# EAGLE design single_digit_v1 (EAGLE 6.5.0)
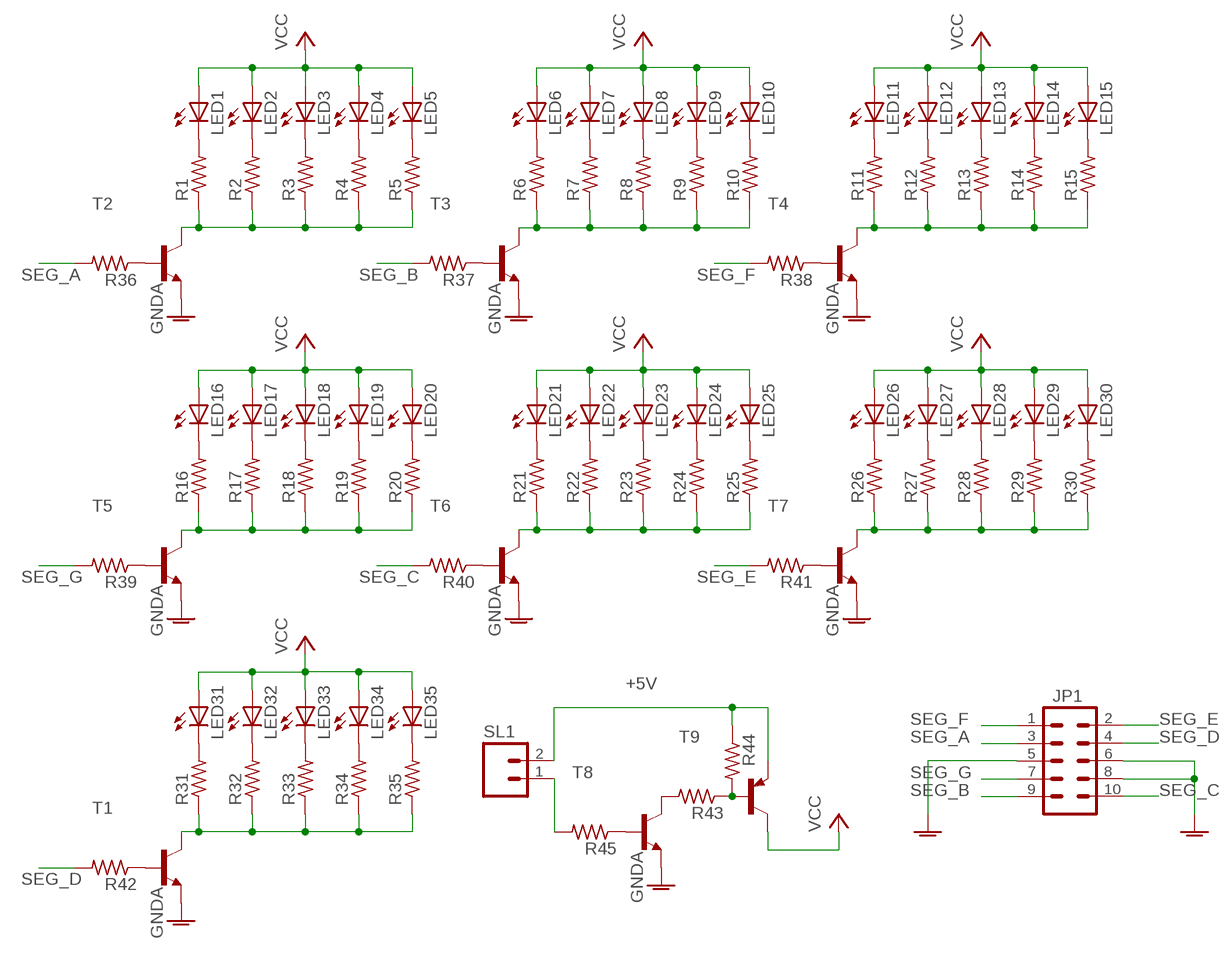
[diagram p0: schematic, sheet 1]

## Parts
JP1  M05X2SHD_SMD  [2X5-SHROUDED_SMD]
LED1  LED5MM  [LED5MM]
LED2  LED5MM  [LED5MM]
LED3  LED5MM  [LED5MM]
LED4  LED5MM  [LED5MM]
LED5  LED5MM  [LED5MM]
LED6  LED5MM  [LED5MM]
LED7  LED5MM  [LED5MM]
LED8  LED5MM  [LED5MM]
LED9  LED5MM  [LED5MM]
LED10  LED5MM  [LED5MM]
LED11  LED5MM  [LED5MM]
LED12  LED5MM  [LED5MM]
LED13  LED5MM  [LED5MM]
LED14  LED5MM  [LED5MM]
LED15  LED5MM  [LED5MM]
LED16  LED5MM  [LED5MM]
LED17  LED5MM  [LED5MM]
LED18  LED5MM  [LED5MM]
LED19  LED5MM  [LED5MM]
LED20  LED5MM  [LED5MM]
LED21  LED5MM  [LED5MM]
LED22  LED5MM  [LED5MM]
LED23  LED5MM  [LED5MM]
LED24  LED5MM  [LED5MM]
LED25  LED5MM  [LED5MM]
LED26  LED5MM  [LED5MM]
LED27  LED5MM  [LED5MM]
LED28  LED5MM  [LED5MM]
LED29  LED5MM  [LED5MM]
LED30  LED5MM  [LED5MM]
LED31  LED5MM  [LED5MM]
LED32  LED5MM  [LED5MM]
LED33  LED5MM  [LED5MM]
LED34  LED5MM  [LED5MM]
LED35  LED5MM  [LED5MM]
R1  R-US_M0805  [M0805]
R2  R-US_M0805  [M0805]
R3  R-US_M0805  [M0805]
R4  R-US_M0805  [M0805]
R5  R-US_M0805  [M0805]
R6  R-US_M0805  [M0805]
R7  R-US_M0805  [M0805]
R8  R-US_M0805  [M0805]
R9  R-US_M0805  [M0805]
R10  R-US_M0805  [M0805]
R11  R-US_M0805  [M0805]
R12  R-US_M0805  [M0805]
R13  R-US_M0805  [M0805]
R14  R-US_M0805  [M0805]
R15  R-US_M0805  [M0805]
R16  R-US_M0805  [M0805]
R17  R-US_M0805  [M0805]
R18  R-US_M0805  [M0805]
R19  R-US_M0805  [M0805]
R20  R-US_M0805  [M0805]
R21  R-US_M0805  [M0805]
R22  R-US_M0805  [M0805]
R23  R-US_M0805  [M0805]
R24  R-US_M0805  [M0805]
R25  R-US_M0805  [M0805]
R26  R-US_M0805  [M0805]
R27  R-US_M0805  [M0805]
R28  R-US_M0805  [M0805]
R29  R-US_M0805  [M0805]
R30  R-US_M0805  [M0805]
R31  R-US_M0805  [M0805]
R32  R-US_M0805  [M0805]
R33  R-US_M0805  [M0805]
R34  R-US_M0805  [M0805]
R35  R-US_M0805  [M0805]
R36  R-US_M0805  [M0805]
R37  R-US_M0805  [M0805]
R38  R-US_M0805  [M0805]
R39  R-US_M0805  [M0805]
R40  R-US_M0805  [M0805]
R41  R-US_M0805  [M0805]
R42  R-US_M0805  [M0805]
R43  R-US_M0805  [M0805]
R44  R-US_M0805  [M0805]
R45  R-US_M0805  [M0805]
SL1  M02  [02P]
T1  MMBT2222ALT1-NPN-SOT23-BEC  [SOT23-BEC]
T2  MMBT2222ALT1-NPN-SOT23-BEC  [SOT23-BEC]
T3  MMBT2222ALT1-NPN-SOT23-BEC  [SOT23-BEC]
T4  MMBT2222ALT1-NPN-SOT23-BEC  [SOT23-BEC]
T5  MMBT2222ALT1-NPN-SOT23-BEC  [SOT23-BEC]
T6  MMBT2222ALT1-NPN-SOT23-BEC  [SOT23-BEC]
T7  MMBT2222ALT1-NPN-SOT23-BEC  [SOT23-BEC]
T8  MMBT2222ALT1-NPN-SOT23-BEC  [SOT23-BEC]
T9  MMBT2907ALT1-PNP-SOT23-BEC  [SOT23-BEC]

## Nets
+5V: R44.1 SL1.2 T9.E
GNDA: JP1.5 JP1.6 JP1.8 T1.E T2.E T3.E T4.E T5.E T6.E T7.E T8.E
N$1: LED1.K(C) R1.2
N$2: LED2.K(C) R2.2
N$3: LED3.K(C) R3.2
N$4: LED4.K(C) R4.2
N$5: LED5.K(C) R5.2
N$6: LED6.K(C) R6.2
N$7: LED7.K(C) R7.2
N$8: LED8.K(C) R8.2
N$9: LED9.K(C) R9.2
N$10: LED10.K(C) R10.2
N$11: LED11.K(C) R11.2
N$12: LED12.K(C) R12.2
N$13: LED13.K(C) R13.2
N$14: LED14.K(C) R14.2
N$15: LED15.K(C) R15.2
N$16: LED16.K(C) R16.2
N$17: LED17.K(C) R17.2
N$18: LED18.K(C) R18.2
N$19: LED19.K(C) R19.2
N$20: LED20.K(C) R20.2
N$21: LED21.K(C) R21.2
N$22: LED22.K(C) R22.2
N$23: LED23.K(C) R23.2
N$24: LED24.K(C) R24.2
N$25: LED25.K(C) R25.2
N$26: LED26.K(C) R26.2
N$27: LED27.K(C) R27.2
N$28: LED28.K(C) R28.2
N$29: LED29.K(C) R29.2
N$30: LED30.K(C) R30.2
N$31: LED31.K(C) R31.2
N$32: LED32.K(C) R32.2
N$33: LED33.K(C) R33.2
N$34: LED34.K(C) R34.2
N$35: LED35.K(C) R35.2
N$36: R1.1 R2.1 R3.1 R4.1 R5.1 T2.C
N$37: R6.1 R7.1 R8.1 R9.1 R10.1 T3.C
N$38: R11.1 R12.1 R13.1 R14.1 R15.1 T4.C
N$39: R36.1 T2.B
N$40: R37.1 T3.B
N$41: R38.1 T4.B
N$42: R39.1 T5.B
N$43: R16.1 R17.1 R18.1 R19.1 R20.1 T5.C
N$44: R21.1 R22.1 R23.1 R24.1 R25.1 T6.C
N$45: R26.1 R27.1 R28.1 R29.1 R30.1 T7.C
N$46: R40.1 T6.B
N$47: R31.1 R32.1 R33.1 R34.1 R35.1 T1.C
N$48: R41.1 T7.B
N$49: R42.1 T1.B
N$50: R43.2 T8.C
N$51: R43.1 R44.2 T9.B
N$52: R45.1 T8.B
N$53: R45.2 SL1.1
SEG_A: JP1.3 R36.2
SEG_B: JP1.9 R37.2
SEG_C: JP1.10 R40.2
SEG_D: JP1.4 R42.2
SEG_E: JP1.2 R41.2
SEG_F: JP1.1 R38.2
SEG_G: JP1.7 R39.2
VCC: LED1.A LED2.A LED3.A LED4.A LED5.A LED6.A LED7.A LED8.A LED9.A LED10.A LED11.A LED12.A LED13.A LED14.A LED15.A LED16.A LED17.A LED18.A LED19.A LED20.A LED21.A LED22.A LED23.A LED24.A LED25.A LED26.A LED27.A LED28.A LED29.A LED30.A LED31.A LED32.A LED33.A LED34.A LED35.A T9.C

## Library data of the parts
JP1 = SparkFun-Connectors:M05X2: Header 5x2 Standard 10-pin dual row 0.1" header. Commonly used with AVR-ISP. Use with Spark Fun Electronics SKU: PRT-00778
LED1-LED35 = led:LED: LED OSRAM: - CHIPLED LG R971, LG N971, LY N971, LG Q971, LY Q971, LO R971, LY R971 LH N974, LH R974 LS Q976, LO Q976, LY Q976 LO Q996 - Hyper CHIPLED LW Q18S LB Q993, LB Q99A, LB R99A - SideLED LS A670, LO A670, LY A670, LG A670, LP A670 LB A673, LV A673, LT A673, LW A673 LH A674 LY A675 LS A676, LA A676, LO A676, LY A676, LW A676 LS A679, LY A679, LG A679 - Hyper Micro SIDELED® LS Y876, LA Y876, LO Y876, LY Y876 LT Y87S - SmartLED LW L88C, LW L88S LB L89C, LB L89S, LG L890 LS L89K, LO L89K, LY L89K LS L896, LA L896, LO L896, LY L896 - TOPLED LS T670, LO T670, LY T670, LG T670, LP T670 LSG T670, LSP T670, LSY T670, LOP T670, LYG T670 LG T671, LOG T671, LSG T671 LB T673, LV T673, LT T673, LW T673 LH T674 LS T676, LA T676, LO T676, LY T676, LB T676, LH T676, LSB T676, LW T676 LB T67C, LV T67C, LT T67C, LS T67K, LO T67K, LY T67K, LW E67C LS E67B, LA E67B, LO E67B, LY E67B, LB E67C, LV E67C, LT E67C LW T67C LS T679, LY T679, LG T679 LS T770, LO T770, LY T770, LG T770, LP T770 LB T773, LV T773, LT T773, LW T773 LH T774 LS E675, LA E675, LY E675, LS T675 LS T776, LA T776, LO T776, LY T776, LB T776 LHGB T686 LT T68C, LB T68C - Hyper Mini TOPLED® LB M676 - Mini TOPLED Santana® LG M470 LS M47K, LO M47K, LY M47K Source: http://www.osram.convergy.de LUXEON: - LUMILED® LXK2-PW12-R00, LXK2-PW12-S00, LXK2-PW14-U00, LXK2-PW14-V00 LXK2-PM12-R00, LXK2-PM12-S00, LXK2-PM14-U00 LXK2-PE12-Q00, LXK2-PE12-R00, LXK2-PE12-S00, LXK2-PE14-T00, LXK2-PE14-U00 LXK2-PB12-K00, LXK2-PB12-L00, LXK2-PB12-M00, LXK2-PB14-N00, LXK2-PB14-P00, LXK2-PB14-Q00 LXK2-PR12-L00, LXK2-PR12-M00, LXK2-PR14-Q00, LXK2-PR14-R00 LXK2-PD12-Q00, LXK2-PD12-R00, LXK2-PD12-S00 LXK2-PH12-R00, LXK2-PH12-S00 LXK2-PL12-P00, LXK2-PL12-Q00, LXK2-PL12-R00 Source: www.luxeon.com KINGBRIGHT: KA-3528ASYC Source: www.kingbright.com
R1-R45 = rcl:R-US_: RESISTOR, American symbol
SL1 = con-amp-quick:M02: AMP QUICK CONNECTOR; OC_FARNELL: unknown; OC_NEWARK: unknown
T1-T8 = transistor:*-NPN-: NPN Transistror BF959 corrected 2008.03.06
T9 = transistor:*-PNP-: PNP Transistror

## Board
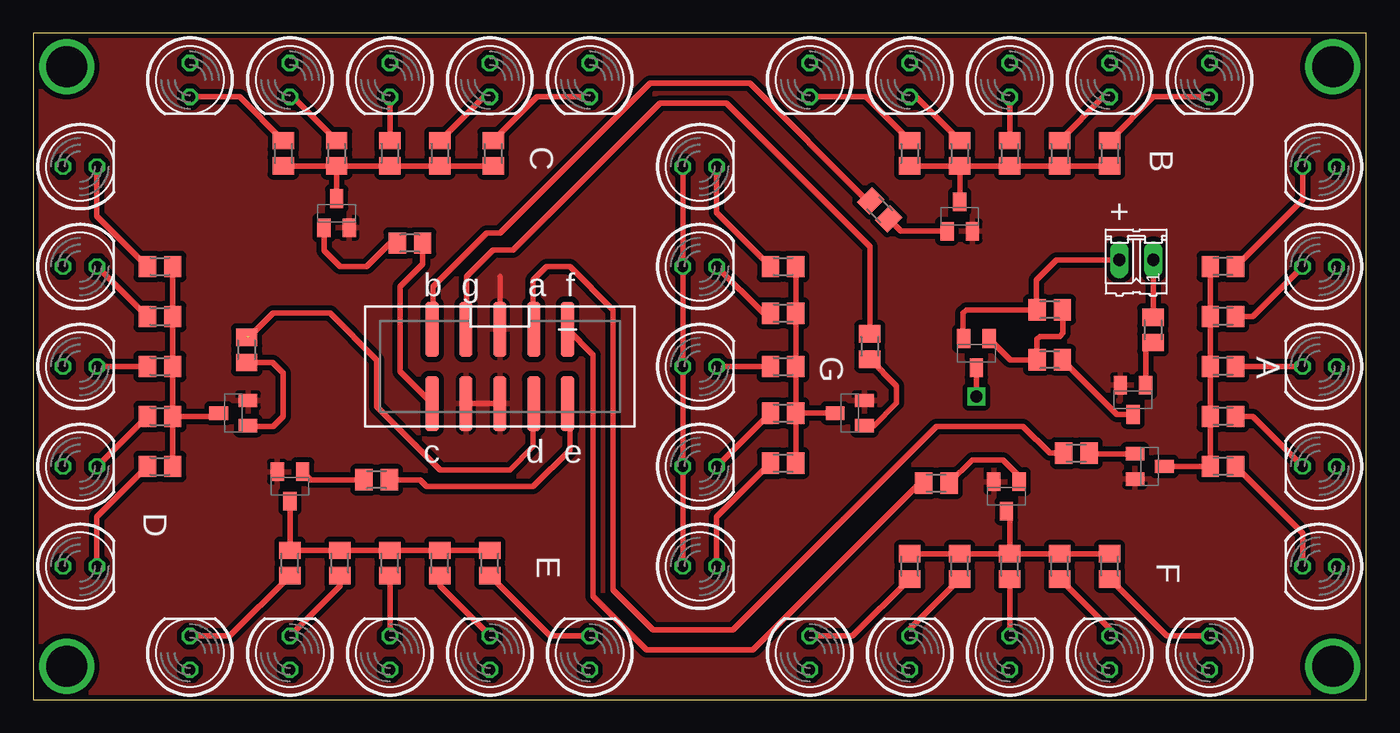
[diagram p1: board, top side]
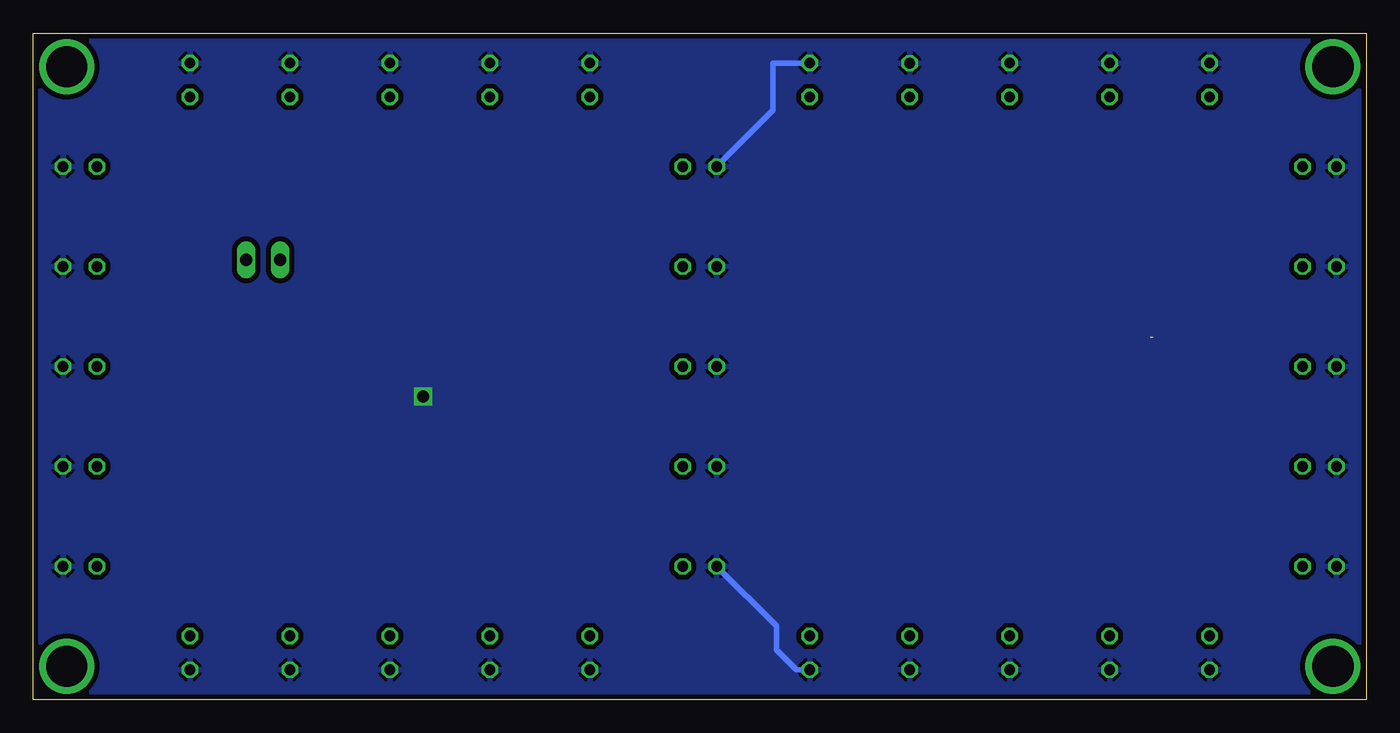
[diagram p2: board, bottom side, seen from below]

Size 100 x 50 mm. Coordinates in mm from the lower left corner, seen from the top.
Outline: 0,0 100,0 100,50 0,50 0,0
Copper layers (1*16): Top 0.035mm / dielectric 0.2mm / Bottom 0.035mm
Design rules "SeeedStudio_DRU_no_angle_20130527 *": minimum track width 6mil, minimum drill 12mil, track to track 6mil, track to pad 6mil, pad to pad 6mil, via to via 6mil, smd to smd 0mil, copper to edge 10mil, drill to drill 10mil, minimum pad ring 6mil, minimum via ring 6mil, stop-mask expansion 2mil, vias tented up to drill 25mil, thermal gap 10mil

### Footprints (pad centres in the part's own frame; a part is rotated, then mirrored left to right if it is on the bottom)
2X5-SHROUDED_SMD = smd 4.15 x 1: 1 -2.794,5.08; 2 2.794,5.08; 3 -2.794,2.54; 4 2.794,2.54; 5 -2.794,0; 6 2.794,0; 7 -2.794,-2.54; 8 2.794,-2.54; 9 -2.794,-5.08; 10 2.794,-5.08
LED5MM = drill 0.813 octagon: A -1.27,0; K 1.27,0
M0805 = smd 1.3 x 1.6: 1 -0.95,0; 2 0.95,0
02P = drill 0.914 long: 1 -1.27,0; 2 1.27,0
SOT23-BEC = smd 1 x 1.4: B -0.95,-1.1; C 0,1.1; E 0.95,-1.1

### Placement (x,y rotation side)
JP1  35,25 270 top
LED1  96.5,40 180 top
LED2  96.5,32.5 180 top
LED3  96.5,25 180 top
LED4  96.5,17.5 180 top
LED5  96.5,10 180 top
LED6  88.25,46.5 270 top
LED7  80.75,46.5 270 top
LED8  73.25,46.5 270 top
LED9  65.75,46.5 270 top
LED10  58.25,46.5 270 top
LED11  88.25,3.5 90 top
LED12  80.75,3.5 90 top
LED13  73.25,3.5 90 top
LED14  65.75,3.5 90 top
LED15  58.25,3.5 90 top
LED16  50,10 0 top
LED17  50,17.5 0 top
LED18  50,25 0 top
LED19  50,32.5 0 top
LED20  50,40 0 top
LED21  41.75,46.5 270 top
LED22  34.25,46.49 270 top
LED23  26.75,46.5 270 top
LED24  19.25,46.5 270 top
LED25  11.75,46.5 270 top
LED26  41.75,3.5 90 top
LED27  34.25,3.5 90 top
LED28  26.75,3.5 90 top
LED29  19.25,3.5 90 top
LED30  11.75,3.5 90 top
LED31  3.5,10 0 top
LED32  3.5,17.5 0 top
LED33  3.5,25 0 top
LED34  3.5,32.5 0 top
LED35  3.5,40 0 top
R1  89.25,32.5 0 top
R2  89.25,28.75 0 top
R3  89.25,25 0 top
R4  89.25,21.25 0 top
R5  89.25,17.5 0 top
R6  80.75,41 90 top
R7  77,41 90 top
R8  73.25,41 90 top
R9  69.5,41 90 top
R10  65.75,41 90 top
R11  80.75,10 270 top
R12  77,10 270 top
R13  73.25,10 270 top
R14  69.5,10 270 top
R15  65.75,10 270 top
R16  56.25,17.75 180 top
R17  56.25,21.5 180 top
R18  56.25,25 180 top
R19  56.25,29 180 top
R20  56.25,32.5 180 top
R21  34.5,41 90 top
R22  30.5,41 90 top
R23  26.75,41 90 top
R24  22.75,41 90 top
R25  18.75,41 90 top
R26  34.25,10.25 270 top
R27  30.5,10.25 270 top
R28  26.75,10.25 270 top
R29  23,10.25 270 top
R30  19.25,10.25 270 top
R31  9.5,17.5 180 top
R32  9.5,21.25 180 top
R33  9.5,25 180 top
R34  9.5,28.75 180 top
R35  9.5,32.5 180 top
R36  78.25,18.5 180 top
R37  63.5,36.75 135 top
R38  67.75,16.25 180 top
R39  62.75,26.5 90 top
R40  28.25,34.25 0 top
R41  25.75,16.5 0 top
R42  16,26.25 90 top
R43  76.25,25.5 0 top
R44  76.25,29.25 0 top
R45  84,27.75 90 top
SL1  82.75,33 180 top
T1  15,21.5 90 top
T2  83.75,17.5 270 top
T3  69.5,36.25 0 top
T4  73,15.25 180 top
T5  61.25,21.5 90 top
T6  22.75,36.5 0 top
T7  19.25,16 180 top
T8  82.5,22.5 180 top
T9  70.75,26 180 top

### Tracks (layer width: path | path; a pad name or v marks a point on that pad's centre or on a via)
+5V
  Top 0.406: SL1.2 76.75,33 75.25,31.5 75.25,29.3 R44.1 70,29.25 69.75,29 69.75,27.15 T9.E
GNDA
  Top 0.406: JP1.5 35,31.75 | JP1.8 JP1.6
  pour Top (isolate 0.381): 0.5,49.5 0.5,0.5 99.5,0.5 99.5,49.5
N$1
  Top 0.406: R1.2 95.23,37.53 LED1.K
N$2
  Top 0.406: R2.2 91.48,28.75 LED2.K
N$3
  Top 0.406: R3.2 LED3.K
N$4
  Top 0.406: LED4.K 91.48,21.25 R4.2
N$5
  Top 0.406: R5.2 95.23,12.47 LED5.K
N$6
  Top 0.406: R6.2 84.03,45.23 LED6.K
N$7
  Top 0.406: R7.2 80.28,45.23 LED7.K
N$8
  Top 0.406: R8.2 LED8.K
N$9
  Top 0.406: R9.2 66.22,45.23 LED9.K
N$10
  Top 0.406: R10.2 62.47,45.23 LED10.K
N$11
  Top 0.406: R11.2 85.03,4.77 LED11.K
N$12
  Top 0.406: R12.2 80.75,5.3 LED12.K
N$13
  Top 0.406: R13.2 LED13.K
N$14
  Top 0.406: R14.2 65.75,5.3 LED14.K
N$15
  Top 0.406: R15.2 61.47,4.77 LED15.K
N$16
  Top 0.406: R16.2 51.27,13.72 LED16.K
N$17
  Top 0.406: R17.2 51.3,17.5 LED17.K
N$18
  Top 0.406: R18.2 LED18.K
N$19
  Top 0.406: R19.2 54.77,29 LED19.K
N$20
  Top 0.406: R20.2 51.27,36.53 LED20.K
N$21
  Top 0.406: R21.2 37.78,45.23 LED21.K
N$22
  Top 0.406: R22.2 33.77,45.22 LED22.K
N$23
  Top 0.406: R23.2 LED23.K
N$24
  Top 0.406: R24.2 19.47,45.23 LED24.K
N$25
  Top 0.406: R25.2 15.47,45.23 LED25.K
N$26
  Top 0.406: R26.2 38.78,4.77 LED26.K
N$27
  Top 0.406: LED27.K 30.5,8.52 R27.2
N$28
  Top 0.406: R28.2 LED28.K
N$29
  Top 0.406: LED29.K 23,8.52 R29.2
N$30
  Top 0.406: R30.2 14.72,4.77 LED30.K
N$31
  Top 0.406: R31.2 4.77,13.72 LED31.K
N$32
  Top 0.406: R32.2 4.8,17.5 LED32.K
N$33
  Top 0.406: R33.2 LED33.K
N$34
  Top 0.406: R34.2 4.8,32.5 LED34.K
N$35
  Top 0.406: R35.2 4.77,36.28 LED35.K
N$36
  Top 0.406: R1.1 R2.1 R3.1 R4.1 R5.1 T2.C
N$37
  Top 0.406: R10.1 R9.1 | R9.1 R8.1 R7.1 R6.1 | T3.C R9.1
N$38
  Top 0.406: R15.1 R14.1 R13.1 | R13.1 R12.1 R11.1 | T4.C 73.25,13.9 R13.1
N$39
  Top 0.406: R36.1 79.25,18.45 T2.B
N$40
  Top 0.406: R37.1 65.1,35.15 T3.B
N$41
  Top 0.406: R38.1 70.45,18 72.75,18 73.95,16.8 T4.B
N$42
  Top 0.406: R39.1 64.75,23.55 64.75,22.25 63.05,20.55 T5.B
N$43
  Top 0.406: R20.1 R19.1 R18.1 R17.1 | R17.1 R16.1 | T5.C R17.1
N$44
  Top 0.406: R25.1 R24.1 | R24.1 R23.1 R22.1 R21.1 | T6.C R24.1
N$45
  Top 0.406: R26.1 R27.1 R28.1 R29.1 R30.1 T7.C
N$46
  Top 0.406: R40.1 26.75,34.25 25,32.5 23,32.5 21.8,33.7 T6.B
N$47
  Top 0.406: R35.1 R34.1 R33.1 R32.1 | R32.1 R31.1 | T1.C 13.65,21.25 R32.1
N$48
  Top 0.406: T7.B 20.8,16.5 R41.1
N$49
  Top 0.406: R42.1 17.95,25.3 18.75,24.5 18.75,21.25 18,20.5 16.15,20.5 T1.B
N$50
  Top 0.406: R43.2 81.3,21.4 T8.C
N$51
  Top 0.406: R44.2 77.25,29.2 77.25,27.5 77,27.25 75.5,27.25 75.3,27.05 R43.1 73.3,25.5 T9.B
N$52
  Top 0.406: R45.1 83.45,26.25 T8.B
N$53
  Top 0.406: R45.2 84.02,28.72 SL1.1
N$55  (via drill 3.1)
  other vias: 2.5,47.5
N$56  (via drill 3.1)
  other vias: 97.5,47.5
N$57  (via drill 3.1)
  other vias: 97.5,2.5
N$58  (via drill 3.1)
  other vias: 2.5,2.5
SEG_A
  Top 0.406: JP1.3 37.5,27.83 37.5,31.5 38.5,32.5 40.25,32.5 43.5,29.25 43.5,8.25 46.5,5.25 52.5,5.25 67.75,20.5 74.25,20.5 76.25,18.5 R36.2
SEG_B
  Top 0.406: R37.2 62.58,37.42 53.75,46.25 46.25,46.25 35,35 34,35 30,31 30,27.87 JP1.9
SEG_C
  Top 0.406: JP1.10 27.5,24.63 27.5,31 29.2,32.7 R40.2
SEG_D  (1 unrouted)
  Top 0.406: JP1.4 37.5,22.17 37.5,19 35.75,17.25 30.5,17.25 25.75,22 25.75,25.5 22.25,29 18,29 16.2,27.2
SEG_E
  Top 0.406: R41.2 29,16.5 29.5,16 37.5,16 40.25,18.75 40.25,22.04 JP1.2
SEG_F
  Top 0.406: R38.2 66.5,16.25 54,3.75 46,3.75 42,7.75 42,25.87 JP1.1
SEG_G
  Top 0.406: JP1.7 32.5,27.83 32.5,31.75 34.5,33.75 36,33.75 47,44.75 52,44.75 62.75,34 R39.2
VCC  (via drill 0.89)
  Top 0.406: LED20.A LED19.A LED18.A LED17.A LED16.A | T9.C v70.75,22.75
  Bottom 0.406: LED20.A 44.5,44.23 44.5,47.77 LED21.A | LED16.A 44.25,5.52 44.25,3.75 42.73,2.23 LED26.A
  pour Bottom (isolate 0.381): 0.5,49.5 0.5,0.5 99.5,0.5 99.5,49.5

### Text on the board
tNames: C | B | + | b g a f | G | A | c d e | D | E | F